# EAGLE schematic main-unit-psu (EAGLE 9.6.2)
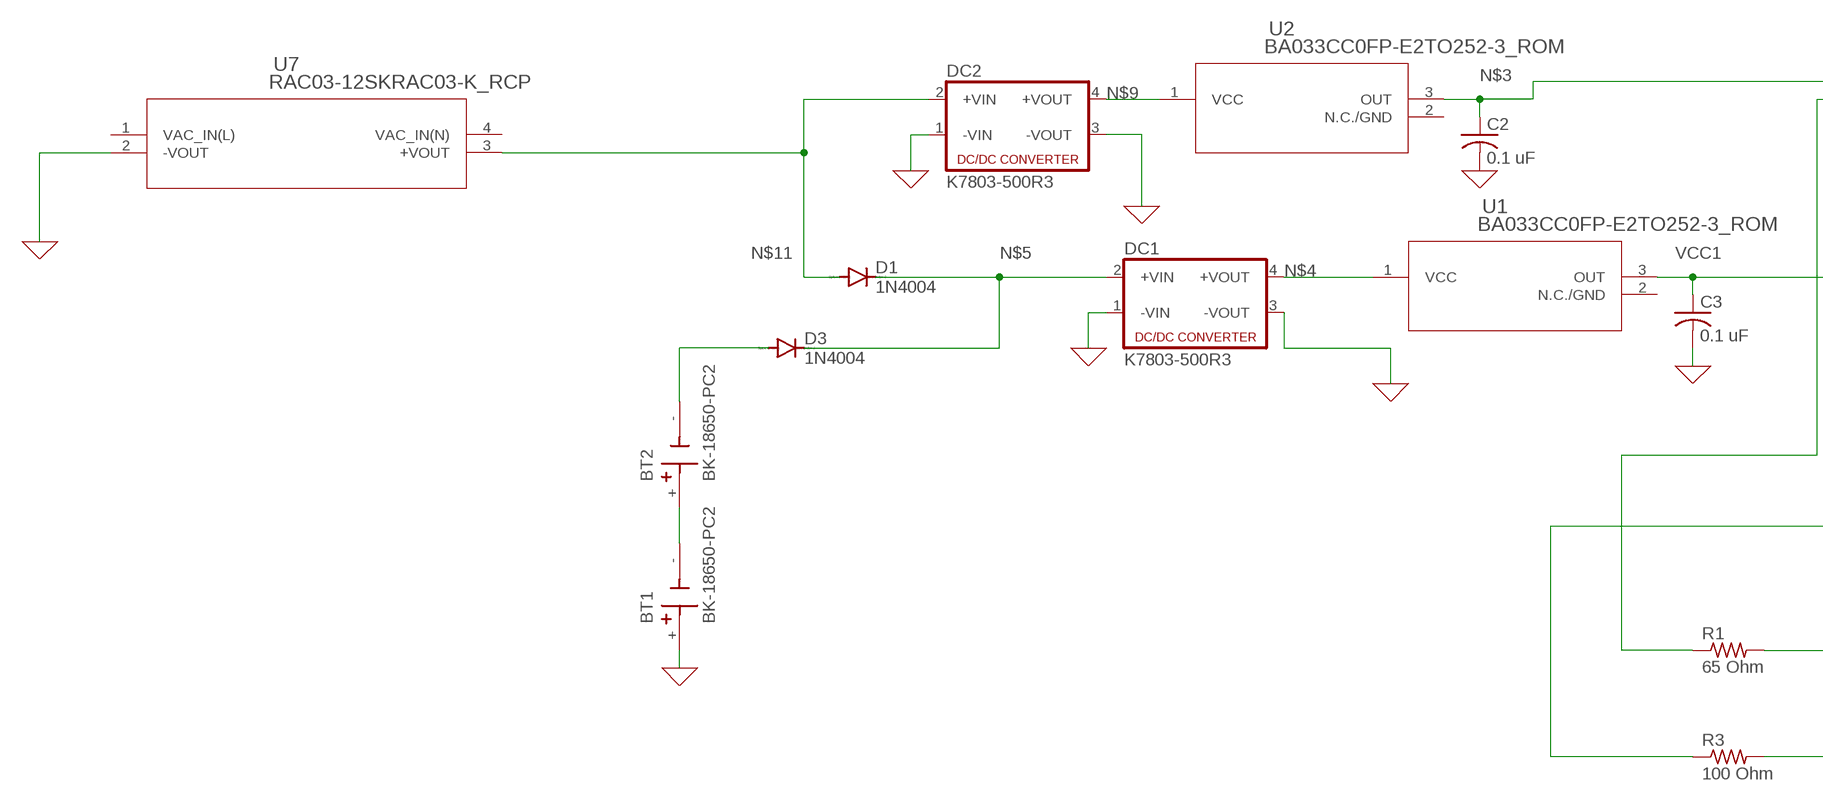
[diagram p0: schematic, sheet 1, part 1 of 2]
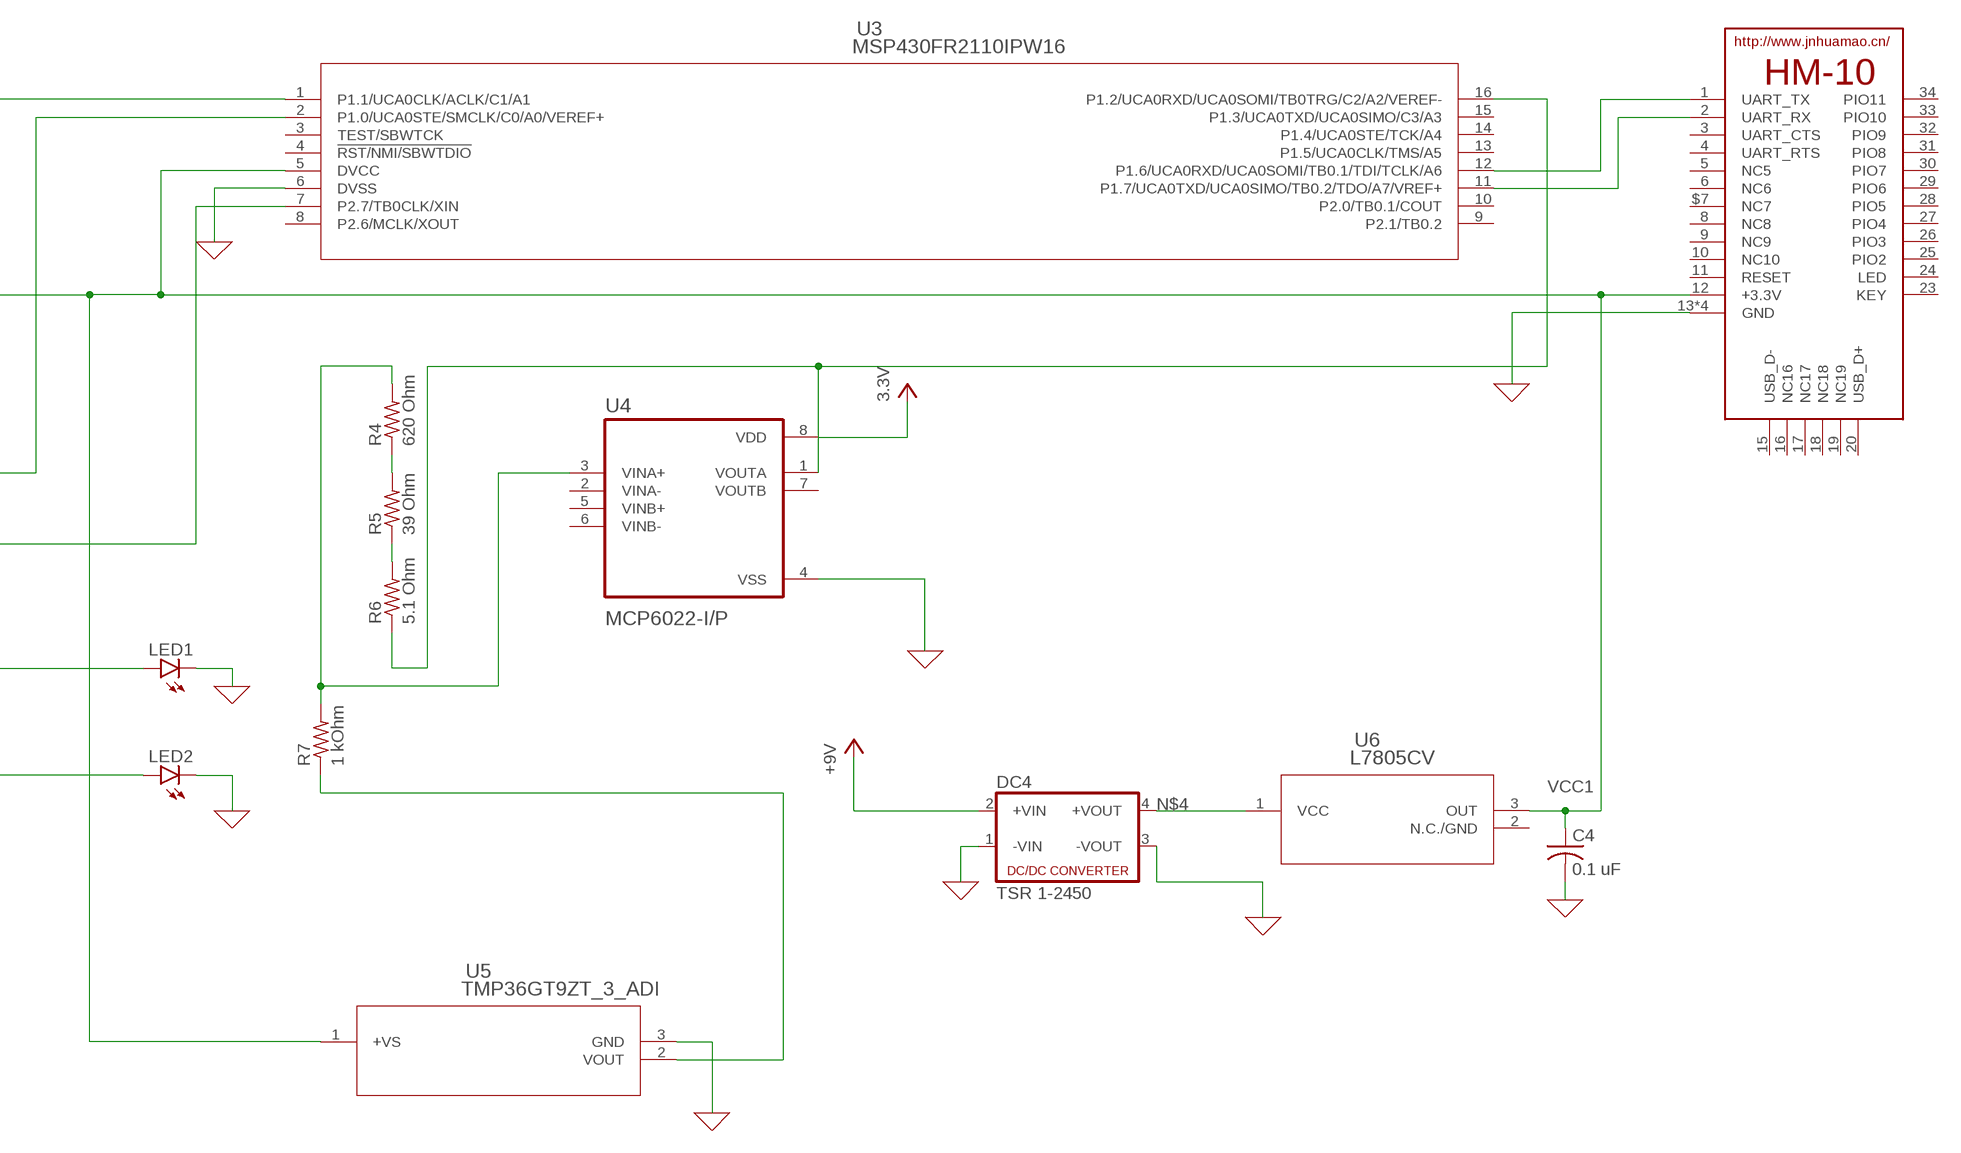
[diagram p1: schematic, sheet 1, part 2 of 2]

## Parts
BT1  BK-18650-PC2  [BAT_BK-18650-PC2]
BT2  BK-18650-PC2  [BAT_BK-18650-PC2]
C2  0.1 uF  C-US050-024X044  [C050-024X044]
C3  0.1 uF  C-US050-024X044  [C050-024X044]
C4  0.1 uF  C-US050-024X044  [C050-024X044]
D1  1N4004  [DO41-10]
D3  1N4004  [DO41-10]
DC1  K7803-500R3  NME  [NME]
DC2  K7803-500R3  NME  [NME]
DC4  TSR 1-2450  NME  [NME]
E1  HM-10-BOARD  [26.9X13X2.2_BOARD]
LED1  LED5MM  [LED5MM]
LED2  LED5MM  [LED5MM]
R1  65 Ohm  R-US_0204/7  [0204/7]
R3  100 Ohm  R-US_0204/7  [0204/7]
R4  620 Ohm  R-US_0204/7  [0204/7]
R5  39 Ohm  R-US_0204/7  [0204/7]
R6  5.1 Ohm  R-US_0204/7  [0204/7]
R7  1 kOhm  R-US_0204/7  [0204/7]
U1  BA033CC0FP-E2TO252-3_ROM  [TO252-3_ROM]
U2  BA033CC0FP-E2TO252-3_ROM  [TO252-3_ROM]
U3  MSP430FR2110IPW16  [PW16_TEX]
U4  MCP6022-I/P  [DIP787W46P254L927H533Q8]
U5  TMP36GT9ZT_3_ADI  [T_3_ADI]
U6  L7805CV  BA033CC0FP-E2TO252-3_ROM  [TO252-3_ROM]
U7  RAC03-12SKRAC03-K_RCP  [RAC03-K_RCP]

## Nets
0: BT1.+ C2.2 C3.2 C4.2 DC1.1(-VIN) DC1.3(-VOUT) DC2.1(-VIN) DC2.3(-VOUT) DC4.1(-VIN) DC4.3(-VOUT) E1.13(GND) E1.14(GND) E1.21(GND) E1.22(GND) LED1.K(C) LED2.K(C) U3.6(DVSS) U4.4(VSS) U5.3(GND) U7.2(-VOUT) ; supply symbol labelled GND
+5V: DC4.2(+VIN) ; supply symbol labelled +9V
N$3: C2.1 U2.3(OUT) U3.1(P1.1/UCA0CLK/ACLK/C1/A1)
N$4: DC1.4(+VOUT) DC4.4(+VOUT) U1.1(VCC) U6.1(VCC)
N$5: D1.C D3.C DC1.2(+VIN)
N$6: BT1.- BT2.+
N$7: BT2.- D3.A
N$9: DC2.4(+VOUT) U2.1(VCC)
N$10: E1.1(UART_TX) U3.12(P1.6/UCA0RXD/UCA0SOMI/TB0.1/TDI/TCLK/A6)
N$11: D1.A DC2.2(+VIN) U7.3(+VOUT)
N$13: E1.2(UART_RX) U3.11(P1.7/UCA0TXD/UCA0SIMO/TB0.2/TDO/A7/VREF+)
N$14: R7.1 U5.2(VOUT)
N$15: R3.1 U3.7(P2.7/TB0CLK/XIN)
N$16: LED1.A R1.2
N$17: LED2.A R3.2
N$18: R5.1 R6.2
N$19: R4.1 R5.2
N$20: R6.1 U3.16(P1.2/UCA0RXD/UCA0SOMI/TB0TRG/C2/A2/VEREF-) U4.1(VOUTA)
N$21: R4.2 R7.2 U4.3(VINA+)
N$22: R1.1 U3.2(P1.0/UCA0STE/SMCLK/C0/A0/VEREF+)
VCC: U4.8(VDD) ; supply symbol labelled 3.3V
VCC1: C3.1 C4.1 E1.12(+3.3V) U1.3(OUT) U3.5(DVCC) U5.1(+VS) U6.3(OUT)
Unconnected: E1.3(UART_CTS) E1.4(UART_RTS) E1.5(NC5) E1.6(NC6) E1.8(NC8) E1.9(NC9) E1.10(NC10) E1.11(RESET) E1.15(USB_D-) E1.16(NC16) E1.17(NC17) E1.18(NC18) E1.19(NC19) E1.20(USB_D+) E1.23(KEY) E1.24(LED) E1.25(PIO2) E1.26(PIO3) E1.27(PIO4) E1.28(PIO5) E1.29(PIO6) E1.30(PIO7) E1.31(PIO8) E1.32(PIO9) E1.33(PIO10) E1.34(PIO11) E1.$7(NC7) U1.2(N.C./GND) U2.2(N.C./GND) U3.3(TEST/SBWTCK) U3.4(!RST/NMI/SBWTDIO) U3.8(P2.6/MCLK/XOUT) U3.9(P2.1/TB0.2) U3.10(P2.0/TB0.1/COUT) U3.13(P1.5/UCA0CLK/TMS/A5) U3.14(P1.4/UCA0STE/TCK/A4) U3.15(P1.3/UCA0TXD/UCA0SIMO/C3/A3) U4.2(VINA-) U4.5(VINB+) U4.6(VINB-) U4.7(VOUTB) U6.2(N.C./GND)

## Power pins joined to a net without a drawn wire
VAC_IN(L): U7.1(VAC_IN(L))
VAC_IN(N): U7.4(VAC_IN(N))

## Library data of the parts
BT1 BT2 = BK-18650-PC2:BK-18650-PC2: Battery Holder (Open) 18650 1 Cell PC Pin Check availability <https://pricing.snapeda.com/parts/BK-18650-PC2/MPD%20%28Memory%20Protection%20Devices%29/view-part?ref=eda>; AVAILABILITY: In Stock; DESCRIPTION: Battery Holder (Open) 18650 1 Cell PC Pin; MF: MPD (Memory Protection Devices); MP: BK-18650-PC2; PACKAGE: None; PRICE: None; PURCHASE-URL: https://pricing.snapeda.com/search/part/BK-18650-PC2/?ref=eda
C2-C4 = rcl:C-US: CAPACITOR, American symbol; SPICEPREFIX: C
D1 D3 = diode:1N4004: DIODE general purpose rectifier, 1 A
DC1 DC2 DC4 = dc-dc-converter:NME: DC-DC CONVERTER; MF: C & D TECHNOLOGIES, INC; MPN: NME1205D; OC_FARNELL: 1021466; OC_NEWARK: 98B8198
E1 = HM-10:HM-10: HM Bluetooth module use TI CC2540 or CC2541, Master and slave roles in one, transmission version and remote control version and PIO state acquisition functions in one, Support the AT command modify module parameters, Convenient and flexible. Check availability <https://pricing.snapeda.com/parts/HM-10/Jinan%20Huamao%20Technology/view-part?ref=eda>; AVAILABILITY: Not in stock; DESCRIPTION: Bluetooth 4.0 module with 4pin base board that can support iphone4s or later.; MF: Jinan Huamao Technology; MP: HM-10; PACKAGE: Package; PRICE: None
LED1 LED2 = led:LED: LED OSRAM: - CHIPLED LG R971, LG N971, LY N971, LG Q971, LY Q971, LO R971, LY R971 LH N974, LH R974 LS Q976, LO Q976, LY Q976 LO Q996 - Hyper CHIPLED LW Q18S LB Q993, LB Q99A, LB R99A - SideLED LS A670, LO A670, LY A670, LG A670, LP A670 LB A673, LV A673, LT A673, LW A673 LH A674 LY A675 LS A676, LA A676, LO A676, LY A676, LW A676 LS A679, LY A679, LG A679 - Hyper Micro SIDELED® LS Y876, LA Y876, LO Y876, LY Y876 LT Y87S - SmartLED LW L88C, LW L88S LB L89C, LB L89S, LG L890 LS L89K, LO L89K, LY L89K LS L896, LA L896, LO L896, LY L896 - TOPLED LS T670, LO T670, LY T670, LG T670, LP T670 LSG T670, LSP T670, LSY T670, LOP T670, LYG T670 LG T671, LOG T671, LSG T671 LB T673, LV T673, LT T673, LW T673 LH T674 LS T676, LA T676, LO T676, LY T676, LB T676, LH T676, LSB T676, LW T676 LB T67C, LV T67C, LT T67C, LS T67K, LO T67K, LY T67K, LW E67C LS E67B, LA E67B, LO E67B, LY E67B, LB E67C, LV E67C, LT E67C LW T67C LS T679, LY T679, LG T679 LS T770, LO T770, LY T770, LG T770, LP T770 LB T773, LV T773, LT T773, LW T773 LH T774 LS E675, LA E675, LY E675, LS T675 LS T776, LA T776, LO T776, LY T776, LB T776 LHGB T686 LT T68C, LB T68C - Hyper Mini TOPLED® LB M676 - Mini TOPLED Santana® LG M470 LS M47K, LO M47K, LY M47K Source: http://www.osram.convergy.de LUXEON: - LUMILED® LXK2-PW12-R00, LXK2-PW12-S00, LXK2-PW14-U00, LXK2-PW14-V00 LXK2-PM12-R00, LXK2-PM12-S00, LXK2-PM14-U00 LXK2-PE12-Q00, LXK2-PE12-R00, LXK2-PE12-S00, LXK2-PE14-T00, LXK2-PE14-U00 LXK2-PB12-K00, LXK2-PB12-L00, LXK2-PB12-M00, LXK2-PB14-N00, LXK2-PB14-P00, LXK2-PB14-Q00 LXK2-PR12-L00, LXK2-PR12-M00, LXK2-PR14-Q00, LXK2-PR14-R00 LXK2-PD12-Q00, LXK2-PD12-R00, LXK2-PD12-S00 LXK2-PH12-R00, LXK2-PH12-S00 LXK2-PL12-P00, LXK2-PL12-Q00, LXK2-PL12-R00 Source: www.luxeon.com KINGBRIGHT: KA-3528ASYC Source: www.kingbright.com
R1 R3-R7 = rcl:R-US_: RESISTOR, American symbol; SPICEPREFIX: R
U1 U2 U6 = 2023-03-08_12-17-23_Library:BA033CC0FP-E2; COPYRIGHT: Copyright (C) 2023 Ultra Librarian. All rights reserved.; DIGI-KEY_PART_NUMBER_1: BA033CC0FP-E2TR-ND; DIGI-KEY_PART_NUMBER_2: BA033CC0FP-E2CT-ND; DIGI-KEY_PART_NUMBER_3: BA033CC0FP-E2DKR-ND; MANUFACTURER_PART_NUMBER: BA033CC0FP-E2; MFR_NAME: ROHM Semiconductor
U3 = MSP430FR2110:MSP430FR2110IPW16; COPYRIGHT: Copyright (C) 2023 Ultra Librarian. All rights reserved.; MANUFACTURER_PART_NUMBER: MSP430FR2110IPW16; MFR_NAME: Texas Instruments
U4 = MCP6022-I_P:MCP6022-I/P
U5 = 2023-03-28_14-12-25_Library:TMP36GT9Z; COPYRIGHT: Copyright (C) 2023 Ultra Librarian. All rights reserved.; DIGI-KEY_PART_NUMBER_1: TMP36GT9Z-ND; DIGI-KEY_PART_NUMBER_2: 2156-TMP36GT9Z-ND; MANUFACTURER_PART_NUMBER: TMP36GT9Z; MFR_NAME: Analog Devices Inc
U7 = 2023-04-05_11-47-46_Library:RAC03-12SK; COPYRIGHT: Copyright (C) 2023 Ultra Librarian. All rights reserved.; DIGI-KEY_PART_NUMBER_1: 945-3442-ND; MANUFACTURER_PART_NUMBER: RAC03-12SK; MFR_NAME: Recom Power